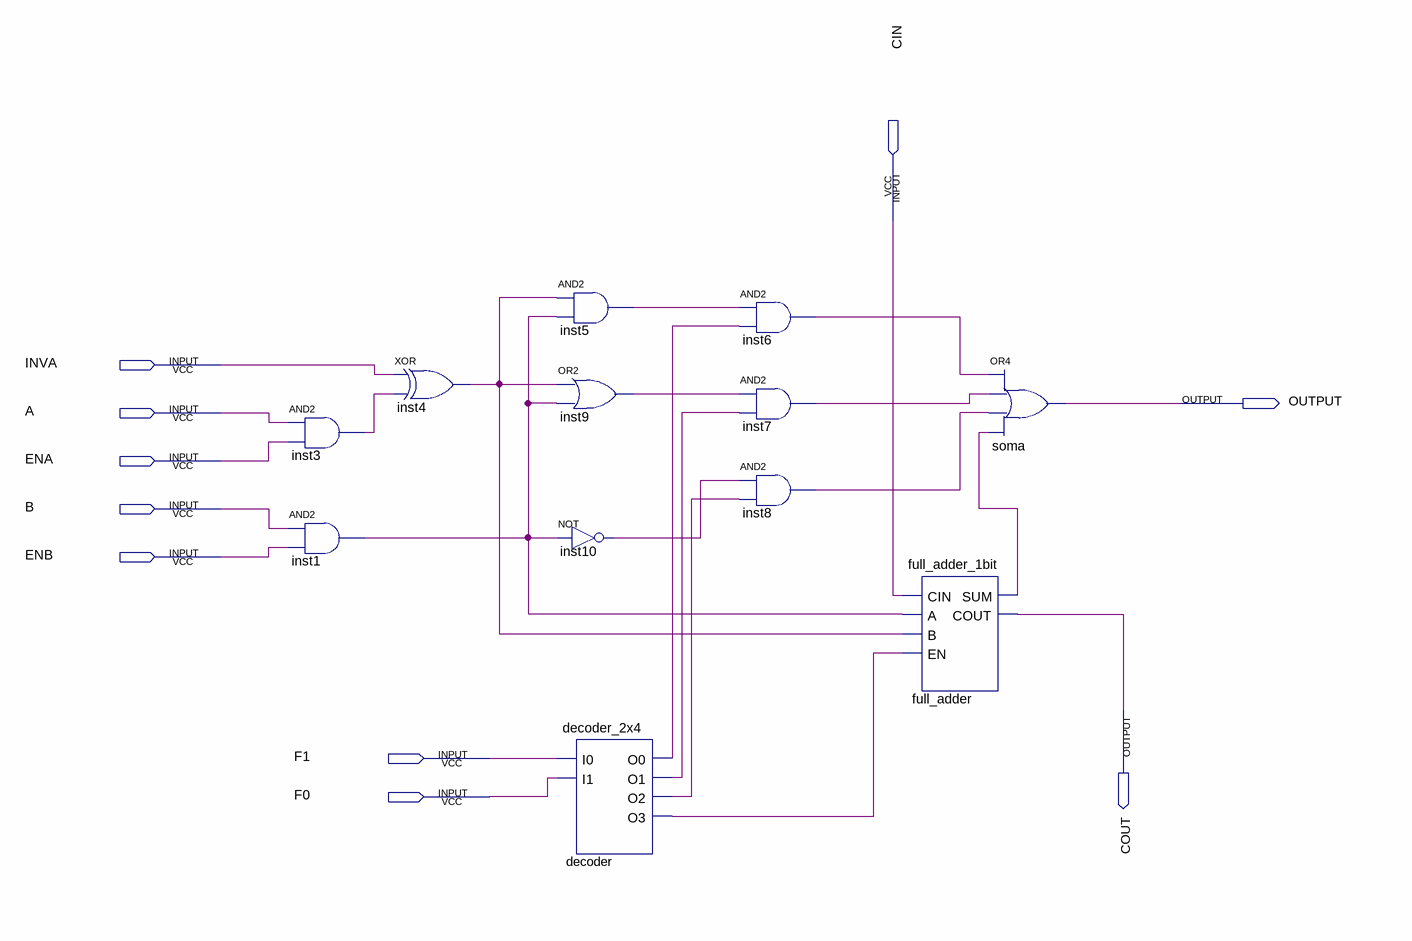
[diagram p0: schematic sheet]
// Quartus schematic ULA_1bit.bdf as structural Verilog: 12 symbols, 10 pins
module ULA_1bit (
  input  CIN,
  input  INVA,
  input  A,
  input  ENA,
  input  B,
  input  ENB,
  input  F1,
  input  F0,
  output OUTPUT,
  output COUT
);

  wire decoder_o0, decoder_o1, decoder_o2, decoder_o3, full_adder_sum, inst1_out, inst3_out, inst4_out,
       inst5_out, inst6_out, inst7_out, inst8_out, inst9_out, inst10_out;

  and inst3 (inst3_out, A, ENA);
  and inst1 (inst1_out, B, ENB);
  xor inst4 (inst4_out, INVA, inst3_out);
  and inst5 (inst5_out, inst4_out, inst1_out);
  or inst9 (inst9_out, inst4_out, inst1_out);
  not inst10 (inst10_out, inst1_out);
  decoder_2x4 decoder (.I0(F1), .I1(F0), .O0(decoder_o0), .O1(decoder_o1), .O2(decoder_o2), .O3(decoder_o3));
  and inst6 (inst6_out, inst5_out, decoder_o0);
  and inst7 (inst7_out, inst9_out, decoder_o1);
  and inst8 (inst8_out, inst10_out, decoder_o2);
  full_adder_1bit full_adder (
    .CIN(CIN), .A(inst1_out), .B(inst4_out), .EN(decoder_o3), .SUM(full_adder_sum), .COUT(COUT));
  or soma (OUTPUT, inst6_out, inst7_out, inst8_out, full_adder_sum);
endmodule
